# EAGLE design telemetry-4L (EAGLE 7.7.0)
COMPANY: FAR; REV: 3

## Sheet 1 of 2
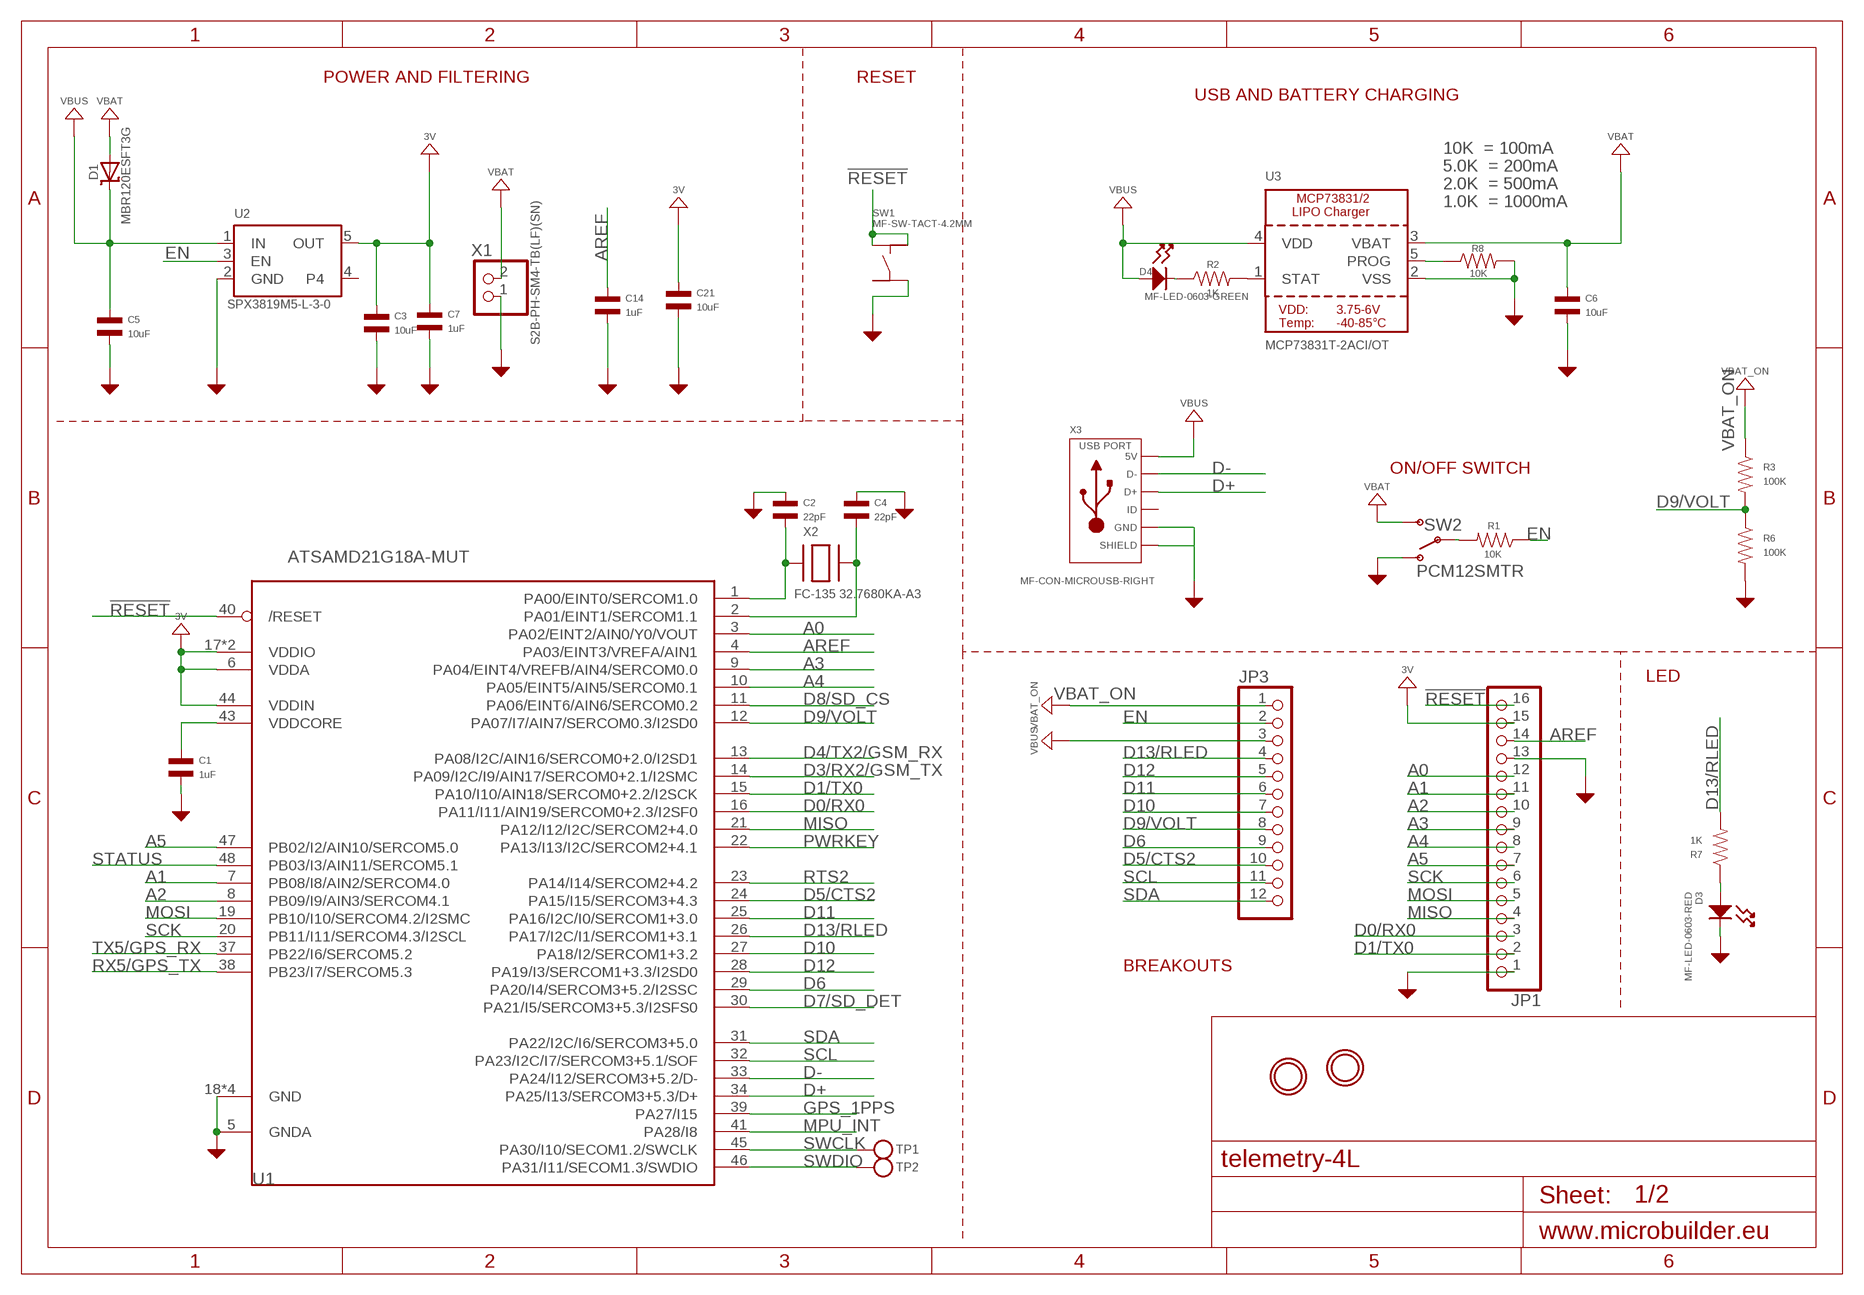
[diagram p0: schematic, sheet 1]
FRAME1 (FRAME_A4): POPULATE: 0

### Parts
C1  1uF  CAPACITOR_NP_0402  [C0402]
C2  22pF  CAPACITOR_NP_0402  [C0402]
C3  10uF  CAPACITOR_NP_0603  [C0603]
C4  22pF  CAPACITOR_NP_0402  [C0402]
C5  10uF  CAPACITOR_NP_0603  [C0603]
C6  10uF  CAPACITOR_NP_0603  [C0603]
C7  1uF  CAPACITOR_NP_0402  [C0402]
C14  1uF  CAPACITOR_NP_0402  [C0402]
C21  10uF  CAPACITOR_NP_0603  [C0603]
D1  MBR120ESFT3G  DIODE-SCHOTTKYSOD-123  [SOD-123]
D3  MF-LED-0603-RED  LED_SINGLE-0603-RED  [LED0603]
D4  MF-LED-0603-GREEN  LED_SINGLE-0603-GREEN  [LED0603]
JP1  HEADER-1X16ROUND  [1X16_ROUND]
JP3  HEADER-1X12  [1X12_ROUND]
R1  10K  RESISTOR_0402  [R0402]
R2  1K  RESISTOR_0402  [R0402]
R3  100K  RESISTOR_0402  [R0402]
R6  100K  RESISTOR_0402  [R0402]
R7  1K  RESISTOR_0402  [R0402]
R8  10K  RESISTOR_0402  [R0402]
SW1  MF-SW-TACT-4.2MM  TACT_4.2MM  [TACT4.2MM]
SW2  PCM12SMTR  SWITCH_SPDT  [KPS-1290]
TP1  TESTPOINTROUND1.5MM  [TESTPOINT_ROUND_1.5MM]
TP2  TESTPOINTROUND1.5MM  [TESTPOINT_ROUND_1.5MM]
U1  ATSAMD21G18A-MUT  ATSAMD21J_QFN  [TQFN48_7MM]
U2  SPX3819M5-L-3-0  VREG_SOT23-5  [SOT23-5]
U3  MCP73831T-2ACI/OT  MCP73831/2  [SOT23-5]
U$31  MOUNTINGHOLE2.5  [MOUNTINGHOLE_2.5_PLATED]
U$32  MOUNTINGHOLE2.5  [MOUNTINGHOLE_2.5_PLATED]
X1  S2B-PH-SM4-TB(LF)(SN)  CON_JST_PH_2PIN  [JSTPH2]
X2  FC-135 32.7680KA-A3  XTAL-3.2X1.5  [XTAL3215]
X3  MF-CON-MICROUSB-RIGHT  USB_MICRO_RIGHT  [MICROUSB-RIGHT]

### Nets
!RESET: JP1.16 SW1.P$1 SW1.P$2 U1.40(/RESET)
+3V: C3.P$1 C7.P$1 C21.P$1 JP1.15 U1.6(VDDA) U1.17(VDDIO) U1.36(VDDIO) U1.44(VDDIN) U2.5(OUT) ; supply symbol labelled 3V ; also sheet 2
A0: JP1.12 U1.3(PA02/EINT2/AIN0/Y0/VOUT)
A1: JP1.11 U1.7(PB08/I8/AIN2/SERCOM4.0)
A2: JP1.10 U1.8(PB09/I9/AIN3/SERCOM4.1)
A3: JP1.9 U1.9(PA04/EINT4/VREFB/AIN4/SERCOM0.0)
A4: JP1.8 U1.10(PA05/EINT5/AIN5/SERCOM0.1)
A5: JP1.7 U1.47(PB02/I2/AIN10/SERCOM5.0)
AREF: C14.P$1 JP1.14 U1.4(PA03/EINT3/VREFA/AIN1)
D0/RX0: JP1.3 U1.16(PA11/I11/AIN19/SERCOM0+2.3/I2SF0)
D1/TX0: JP1.2 U1.15(PA10/I10/AIN18/SERCOM0+2.2/I2SCK)
D3/RX2/GSM_TX: U1.14(PA09/I2C/I9/AIN17/SERCOM0+2.1/I2SMC) ; also sheet 2
D4/TX2/GSM_RX: U1.13(PA08/I2C/AIN16/SERCOM0+2.0/I2SD1) ; also sheet 2
D5/CTS2: JP3.10 U1.24(PA15/I15/SERCOM3+4.3) ; also sheet 2
D6: JP3.9 U1.29(PA20/I4/SERCOM3+5.2/I2SSC)
D7/SD_DET: U1.30(PA21/I5/SERCOM3+5.3/I2SFS0) ; also sheet 2
D8/SD_CS: U1.11(PA06/EINT6/AIN6/SERCOM0.2) ; also sheet 2
D9/VOLT: JP3.8 R3.P$2 R6.P$1 U1.12(PA07/I7/AIN7/SERCOM0.3/I2SD0)
D10: JP3.7 U1.27(PA18/I2/SERCOM1+3.2)
D11: JP3.6 U1.25(PA16/I2C/I0/SERCOM1+3.0)
D12: JP3.5 U1.28(PA19/I3/SERCOM1+3.3/I2SD0)
D13/RLED: JP3.4 R7.P$2 U1.26(PA17/I2C/I1/SERCOM1+3.1)
D+: U1.34(PA25/I13/SERCOM3+5.3/D+) X3.3(D+)
D-: U1.33(PA24/I12/SERCOM3+5.2/D-) X3.2(D-)
EN: JP3.2 R1.P$1 U2.3(EN) ; also sheet 2
GND: C1.P$2 C2.P$1 C3.P$2 C4.P$1 C5.P$2 C6.P$2 C7.P$2 C14.P$2 C21.P$2 D3.CATHODE JP1.1 JP1.13 R6.P$2 R8.P$2 SW1.P$4 SW2.O U1.5(GNDA) U1.18(GND) U1.35(GND) U1.42(GND) U1.THERMAL(GND) U2.2(GND) U3.2(VSS) X1.1 X3.5(GND) X3.S1(SLD) X3.S2(SLD) X3.S3(SLD) X3.S4(SLD) X3.S5(SLD) X3.S6(SLD) ; also sheet 2
GPS_1PPS: U1.39(PA27/I15) ; also sheet 2
MISO: JP1.4 U1.21(PA12/I12/I2C/SERCOM2+4.0) ; also sheet 2
MOSI: JP1.5 U1.19(PB10/I10/SERCOM4.2/I2SMC) ; also sheet 2
MPU_INT: U1.41(PA28/I8) ; also sheet 2
N$1: D4.CATHODE R2.P$1
N$3: R2.P$2 U3.1(STAT)
N$4: R8.P$1 U3.5(PROG)
N$5: C2.P$2 U1.1(PA00/EINT0/SERCOM1.0) X2.P$1
N$7: C4.P$2 U1.2(PA01/EINT1/SERCOM1.1) X2.P$2
N$8: D3.ANODE R7.P$1
N$11: R1.P$2 SW2.P
PWRKEY: U1.22(PA13/I13/I2C/SERCOM2+4.1) ; also sheet 2
RTS2: U1.23(PA14/I14/SERCOM2+4.2) ; also sheet 2
RX5/GPS_TX: U1.38(PB23/I7/SERCOM5.3) ; also sheet 2
SCK: JP1.6 U1.20(PB11/I11/SERCOM4.3/I2SCL) ; also sheet 2
SCL: JP3.11 U1.32(PA23/I2C/I7/SERCOM3+5.1/SOF) ; also sheet 2
SDA: JP3.12 U1.31(PA22/I2C/I6/SERCOM3+5.0) ; also sheet 2
STATUS: U1.48(PB03/I3/AIN11/SERCOM5.1) ; also sheet 2
SWCLK: TP1.P$1 U1.45(PA30/I10/SECOM1.2/SWCLK) ; also sheet 2
SWDIO: TP2.P$1 U1.46(PA31/I11/SECOM1.3/SWDIO)
TX5/GPS_RX: U1.37(PB22/I6/SERCOM5.2) ; also sheet 2
VBAT: C6.P$1 D1.A SW2.S U3.3(VBAT) X1.2 ; also sheet 2
VBAT_ON: JP3.1 R3.P$1 ; also sheet 2
VBUS: C5.P$1 D1.C D4.ANODE JP3.3 U2.1(IN) U3.4(VDD) X3.1(5V)
VDDCORE: C1.P$1 U1.43(VDDCORE)
Unconnected: SW1.P$3 U2.4 X3.4(ID)

### Notes on the sheet
- POWER AND FILTERING | RESET
- USB AND BATTERY CHARGING
- 10K  = 100mA
- 5.0K  = 200mA
- 2.0K  = 500mA
- 1.0K  = 1000mA
- ON/OFF SWITCH
- LED
- BREAKOUTS

## Sheet 2 of 2
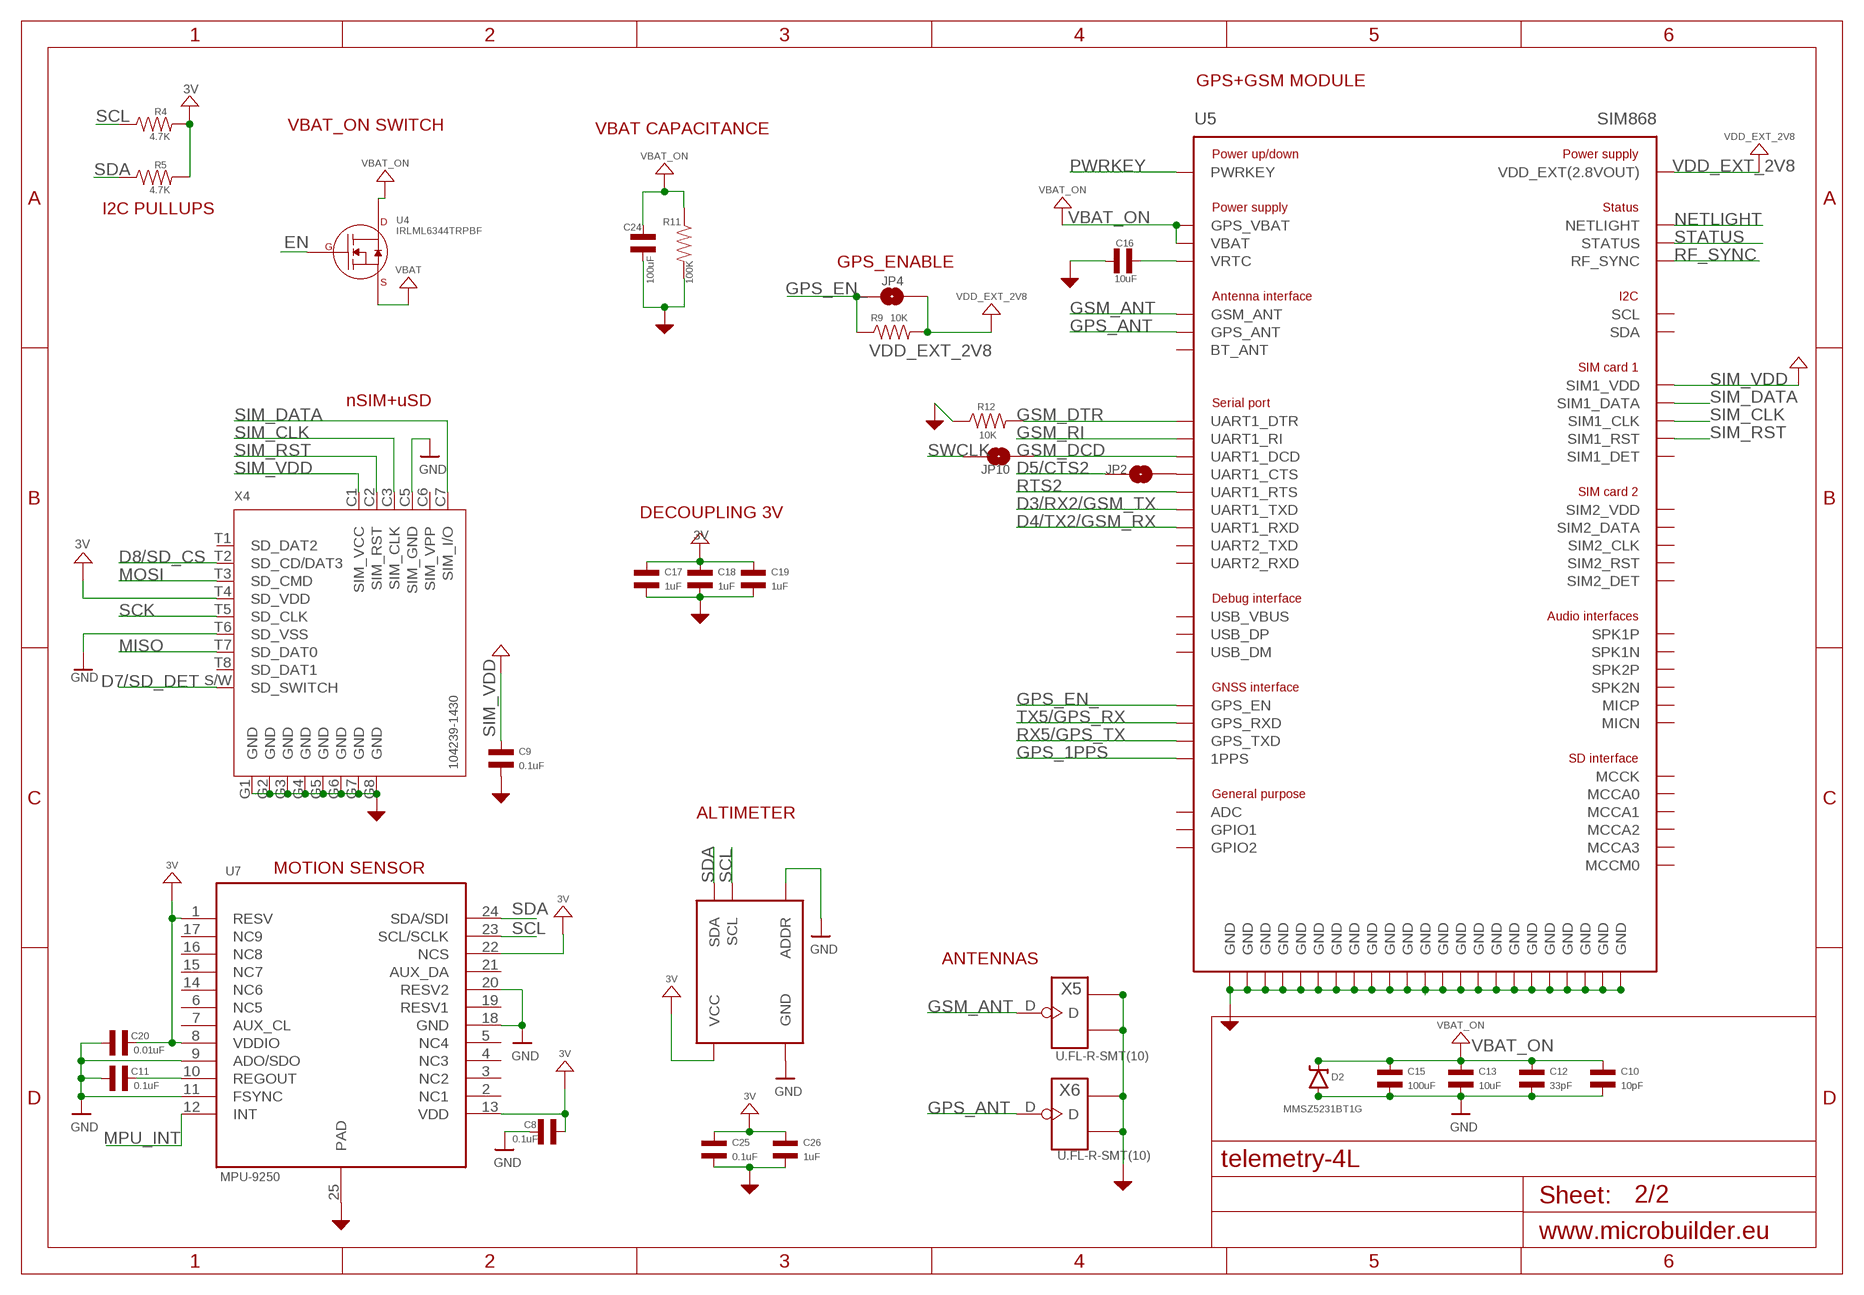
[diagram p1: schematic, sheet 2]
FRAME2 (FRAME_A4): POPULATE: 0

### Parts
C8  0.1uF  CAPACITOR_NP_0402  [C0402]
C9  0.1uF  CAPACITOR_NP_0402  [C0402]
C10  10pF  CAPACITOR_NP_0402  [C0402]
C11  0.1uF  CAPACITOR_NP_0402  [C0402]
C12  33pF  CAPACITOR_NP_0402  [C0402]
C13  10uF  CAPACITOR_NP_0603  [C0603]
C15  100uF  CAPACITOR_NP_1206  [C1206]
C16  10uF  CAPACITOR_NP_0603  [C0603]
C17  1uF  CAPACITOR_NP_0402  [C0402]
C18  1uF  CAPACITOR_NP_0402  [C0402]
C19  1uF  CAPACITOR_NP_0402  [C0402]
C20  0.01uF  CAPACITOR_NP_0402  [C0402]
C24  100uF  CAPACITOR_NP_1206  [C1206]
C25  0.1uF  CAPACITOR_NP_0402  [C0402]
C26  1uF  CAPACITOR_NP_0402  [C0402]
D2  MMSZ5231BT1G  [SOD-123]
JP2  JUMPER-PAD-2-NOYES_SILK  [PAD-JUMPER-2-NO_YES_SILK]
JP4  JUMPER-PAD-2-NOYES_SILK  [PAD-JUMPER-2-NO_YES_SILK]
JP10  JUMPER-PAD-2-NOYES_SILK  [PAD-JUMPER-2-NO_YES_SILK]
R4  4.7K  RESISTOR_0402  [R0402]
R5  4.7K  RESISTOR_0402  [R0402]
R9  10K  RESISTOR_0402  [R0402]
R11  100K  RESISTOR_0402  [R0402]
R12  10K  RESISTOR_0402  [R0402]
U4  IRLML6344TRPBF  N-CHANNEL_FET_SOT-23-3  [SOT-23-3]
U5  SIM868  [SIM868]
U6  BMP280  [LGA-8]
U7  MPU-9250  [LEAD-QFN24]
X4  104239-1430  MOLEX-SD+SIM-104239  [MOLEX-SD+SIM-104239]
X5  U.FL-R-SMT(10)  ANTENNA-CONN-U-FL(3P)  [U-FL3P-SMD-2.6X2.6X1.0MM]
X6  U.FL-R-SMT(10)  ANTENNA-CONN-U-FL(3P)  [U-FL3P-SMD-2.6X2.6X1.0MM]

### Nets
+3V: C8.P$2 C17.P$1 C18.P$1 C19.P$1 C20.P$2 C25.P$1 C26.P$1 R4.P$2 R5.P$2 U6.P2(VCC) U6.P6(VCC) U6.P8(VCC) U7.1(RESV) U7.8(VDDIO) U7.13(VDD) U7.22(NCS) X4.T4(SD_VDD) ; supply symbol labelled 3V ; also sheet 1
D3/RX2/GSM_TX: U5.1_(UART1_TXD) ; also sheet 1
D4/TX2/GSM_RX: U5.2_(UART1_RXD) ; also sheet 1
D5/CTS2: JP2.1 ; also sheet 1
D7/SD_DET: X4.S/W(SD_SWITCH) ; also sheet 1
D8/SD_CS: X4.T2(SD_CD/DAT3) ; also sheet 1
EN: U4.P$1(GATE) ; also sheet 1
GND: C8.P$1 C9.P$2 C10.P$2 C11.P$1 C12.P$2 C13.P$2 C15.P$2 C16.P$1 C17.P$2 C18.P$2 C19.P$2 C20.P$1 C24.P$2 C25.P$2 C26.P$2 D2.A R11.P$2 R12.P$1 U5.8_(GND) U5.13_(GND) U5.19_(GND) U5.21_(GND) U5.27_(GND) U5.30_(GND) U5.31_(GND) U5.33_(GND) U5.36_(GND) U5.37_(GND) U5.45_(GND) U5.63_(GND) U5.66_(GND) U5.67_(GND) U5.69_(GND) U5.70_(GND) U5.71_(GND) U5.72_(GND) U5.73_(GND) U5.74_(GND) U5.75_(GND) U5.76_(GND) U5.77_(GND) U6.P1(GND) U6.P5(ADDR) U6.P7(GND) U7.9(ADO/SDO) U7.11(FSYNC) U7.18(GND) U7.20(RESV2) U7.25(PAD) X4.C5(SIM_GND) X4.G1(GND) X4.G2(GND) X4.G3(GND) X4.G4(GND) X4.G5(GND) X4.G6(GND) X4.G7(GND) X4.G8(GND) X4.T6(SD_VSS) X5.GND1 X5.GND2 X6.GND1 X6.GND2 ; also sheet 1
GPS_1PPS: U5.60_(1PPS) ; also sheet 1
GPS_ANT: U5.68_(GPS_ANT) X6.D
GPS_EN_: JP4.1 R9.P$1 U5.59_(GPS_EN)
GSM_ANT: U5.32_(GSM_ANT) X5.D
GSM_DCD: JP10.2 U5.5_(UART1_DCD)
GSM_DTR: R12.P$2 U5.6_(UART1_DTR)
GSM_RI: U5.7_(UART1_RI)
MISO: X4.T7(SD_DAT0) ; also sheet 1
MOSI: X4.T3(SD_CMD) ; also sheet 1
MPU_INT: U7.12(INT) ; also sheet 1
N$6: JP2.2 U5.4_(UART1_CTS)
N$23: C11.P$2 U7.10(REGOUT)
N$29: C16.P$2 U5.28_(VRTC)
NETLIGHT: U5.41_(NETLIGHT)
PWRKEY: U5.39_(PWRKEY) ; also sheet 1
RF_SYNC: U5.29_(RF_SYNC)
RTS2: U5.3_(UART1_RTS) ; also sheet 1
RX5/GPS_TX: U5.61_(GPS_TXD) ; also sheet 1
SCK: X4.T5(SD_CLK) ; also sheet 1
SCL: R4.P$1 U6.P4(SCL) U7.23(SCL/SCLK) ; also sheet 1
SDA: R5.P$1 U6.P3(SDA) U7.24(SDA/SDI) ; also sheet 1
SIM_CLK: U5.16_(SIM1_CLK) X4.C3(SIM_CLK)
SIM_DATA: U5.15_(SIM1_DATA) X4.C7(SIM_I/O)
SIM_RST: U5.17_(SIM1_RST) X4.C2(SIM_RST)
SIM_VDD: C9.P$1 U5.18_(SIM1_VDD) X4.C1(SIM_VCC)
STATUS: U5.42_(STATUS) ; also sheet 1
SWCLK: JP10.1 ; also sheet 1
TX5/GPS_RX: U5.62_(GPS_RXD) ; also sheet 1
VBAT: U4.P$2(SOURCE) ; also sheet 1
VBAT_ON: C10.P$1 C12.P$1 C13.P$1 C15.P$1 C24.P$1 D2.C R11.P$1 U4.P$3(DRAIN) U5.34_(GPS_VBAT) U5.35_(VBAT) ; also sheet 1
VDD_EXT_2V8: JP4.2 R9.P$2 U5.40_(VDD_EXT(2.8VOUT))
Unconnected: U5.9_(MICP) U5.10_(MICN) U5.11_(SPK1P) U5.12_(SPK1N) U5.14_(SIM1_DET) U5.20_(BT_ANT) U5.22_(UART2_TXD) U5.23_(UART2_RXD) U5.25_(USB_DP) U5.26_(USB_DM) U5.38_(ADC) U5.43_(SPK2N) U5.44_(SPK2P) U5.46_(MCCA3) U5.47_(MCCA2) U5.48_(MCCA1) U5.49_(MCCA0) U5.50_(MCCK) U5.51_(MCCM0) U5.52_(SIM2_DET) U5.53_(SIM2_DATA) U5.54_(SIM2_CLK) U5.55_(SIM2_RST) U5.57_(GPIO1) U5.58_(GPIO2) U5.64_(SDA) U5.65_(SCL) U7.2(NC1) U7.3(NC2) U7.4(NC3) U7.5(NC4) U7.6(NC5) U7.7(AUX_CL) U7.14(NC6) U7.15(NC7) U7.16(NC8) U7.17(NC9) U7.19(RESV1) U7.21(AUX_DA) X4.C6(SIM_VPP) X4.T1(SD_DAT2) X4.T8(SD_DAT1)

### Notes on the sheet
- GPS+GSM MODULE
- VBAT_ON SWITCH | VBAT CAPACITANCE
- I2C PULLUPS
- GPS_ENABLE
- nSIM+uSD
- DECOUPLING 3V
- ALTIMETER
- MOTION SENSOR
- ANTENNAS

## Power pins joined to a net without a drawn wire
SIM2_VDD: U5.56_(SIM2_VDD)
USB_VBUS: U5.24_(USB_VBUS)

## Library data of the parts
C1 C2 C4 C7-C9 C11 C14 C17-C20 C25 C26 = MF_Passives:CAPACITOR_NP: Library: MF_Passives Description: Device for Non-Polarized Capacitors. Manufacture part number (MPN) can be added via Attributes. Check https://factory.macrofab.com/parts for the house parts list.; POPULATE: 1
C3 C5 C6 C13 C16 C21 = MF_Passives:CAPACITOR_NP: Library: MF_Passives Description: Device for Non-Polarized Capacitors. Manufacture part number (MPN) can be added via Attributes. Check https://factory.macrofab.com/parts for the house parts list.; MPN: GRM188R60J106ME47D; POPULATE: 1
C10 = MF_Passives:CAPACITOR_NP: Library: MF_Passives Description: Device for Non-Polarized Capacitors. Manufacture part number (MPN) can be added via Attributes. Check https://factory.macrofab.com/parts for the house parts list.; MPN: GRM1555C1H100JA01J; POPULATE: 1
C12 = MF_Passives:CAPACITOR_NP: Library: MF_Passives Description: Device for Non-Polarized Capacitors. Manufacture part number (MPN) can be added via Attributes. Check https://factory.macrofab.com/parts for the house parts list.; MPN: GRM1555C1H330JA01D; POPULATE: 1
C15 C24 = MF_Passives:CAPACITOR_NP: Library: MF_Passives Description: Device for Non-Polarized Capacitors. Manufacture part number (MPN) can be added via Attributes. Check https://factory.macrofab.com/parts for the house parts list.; MPN: CL31A107MQHNNNE; POPULATE: 1
D1 = microbuilder:DIODE-SCHOTTKY
D2 = Deegou-Diodes:MMSZ5231BT1G: DIODE ZENER 5.1V 500MW SOD123; MFR: ON SEMICONDUCTOR; MPN: MMSZ5231BT1G
D3 = MF_LEDs:LED_SINGLE: Library: MF_LEDs Description: Device for Single LED Packages. Manufacture part number (MFG#) can be added via Attributes.; HOUSEPART: YES; MPN: MF-LED-0603-RED; POPULATE: 1; URL: https://factory.macrofab.com/part/MF-LED-0603-RED
D4 = MF_LEDs:LED_SINGLE: Library: MF_LEDs Description: Device for Single LED Packages. Manufacture part number (MFG#) can be added via Attributes.; HOUSEPART: YES; MPN: MF-LED-0603-GREEN; POPULATE: 1; URL: https://factory.macrofab.com/part/MF-LED-0603-GREEN
JP1 = microbuilder:HEADER-1X16: PIN HEADER; POPULATE: 0
JP2 JP4 JP10 = SparkFun-Passives:JUMPER-PAD-2-NO; POPULATE: 0
JP3 = microbuilder:HEADER-1X12
R1-R9 R11 R12 = MF_Passives:RESISTOR: Library: MF_Passives Description: Device for Resistors. Manufacture part number (MPN), Voltage, Tolerance, and Wattage Rating can be added via Attributes. Check https://factory.macrofab.com/parts for the house parts list.; POPULATE: 1
SW1 = MF_Switches:TACT: Library: MF_Switches Description: Device for Tact Switches. Manufacture part number (MFG#) can be added via Attributes.; HOUSEPART: YES; MPN: MF-SW-TACT-4.2MM; POPULATE: 1; URL: https://factory.macrofab.com/part/MF-SW-TACT-4.2MM
SW2 = SparkFun-Electromechanical:SWITCH_SPDT: SWCH-10651 Side-actuated SPDT slide switch, as used on the Arduino Pro; PROD_ID: SWCH-10651
TP1 TP2 = microbuilder:TESTPOINT: Test Point Various test points for characterisation and PCB testing TESTPOINT_SMT - Compact Surface Mount Test Point [Digikey: 5016KTR-ND]; POPULATE: 0
U1 = microbuilder:ATSAMD21J
U2 = microbuilder:VREG_SOT23-5: SOT23-5 Fixed Voltage Regulators Part Current Out V Out V In V Dropout θJA (°C/W) TJ (°C) Digikey Part No. ADP121 150mA 3.3V 3.4-5.5V 0.09V @ 150mA -- -- ADP121-AUJZ33R7CT-ND ADP121 150mA 3.0V 3.1-5.5V 0.09V @ 150mA -- -- ADP121-AUJZ30R7CT-ND ADP122 300mA 3.3V 3.4-5.5V 0.085V @ 300mA -- -- ADP122AUJZ-3.3-R7CT-ND ADP1712 300mA 3.3V 3.5-5.5V 0.17V @ 300mA -- -- ADP1712AUJZ-3.3-R7TR-ND AP7311 (Low Cost) 150mA 3.3V 3.5-6V 0.15V @ 150mA -- -- AP7311-33WG-7DICT-ND LD39015M18R 150mA 1.8V 1.9V-5.5V 0.08V @ 100mA -- -- 497-6977-1-ND LP2985A-33DBVR 150mA 3.3V 3.3-16V 0.28V @ 150mA 206 150 296-18479-1-ND MCP1824T-3302E/OT 300mA 3.3V 3.5V-6V 0.2V @ 300mA -- -- MCP1824T-3302E/OTCT-ND MIC5205-2.5YM5 TR 150mA 2.5V 2.7-16V 0.165V @ 150mA -- -- 576-1257-2-ND MIC5205-3.0YM5 TR 150mA 3.0V 3.2V-16V 0.165V @ 150mA -- -- 576-1258-2-ND MIC5205-3.3YM5 TR 150mA 3.3V 3.5V-16V 0.165V @ 150mA -- -- 576-1259-2-ND TPS780330220 150mA 3.3V+2.2V 3.6-5.5V 250mV Max -- -- 296-23332-1-ND TDA3663/N1,135 100mA 3.3V 3.5-45V 0.18V @ 50mA -- -- 568-5343-1-ND Max operating temp can be calculated using θJA, TJ (max junction temperature), and power in watts. Set the "Maximum Ambient Temperature" until it reaches TJ ("Max Junction Temperature"), which is the absolute limit for safe use of the regulator: Heat Sink Temperature Calculator <http://www.daycounter.com/Calculators/Heat-Sink-Temperature-Calculator.phtml> For example, With 12V source into a 3.3V LP2985 and a 30mA load, we are dissipating (12V-3.3V) * 0.03A = 0.261W. With a θJA of 206 °C/W, a TJ of 150°C, and 261mW we can safely use the chip without a heat sink up to 75°C (=147.1°C Junction Temperature).
U3 = microbuilder:MCP73831/2: MCP73831/2 LIPO Charger VDD: 3.75 - 6V Temp -40 - 85°C Programmable Charge Rate: 15-500mA NOTE: STAT is a tri-state logic output on the MCP73831 and an open-drain output on the MCP73832. SOT23-5 with 4.2V output and tri-state logic on STAT = MCP73831T-2ACI/OT
U4 = MF_Discrete_Semiconductor:N-CHANNEL_FET: Library: MF_Discrete_Semiconductor Description: Device for Single N-Channel Mosfet. Manufacture part number (MFG#) can be added via Attributes.; HOUSEPART: NO; POPULATE: 1
U5 = SIM868:SIM868; CONSIGN: 1; MPN: SIM868
U6 = BMP280:BMP280: A 100nF capacitor is recommended between Vdd and GND, and also between Vddio and GND. Vdd & Vddio 3.3v I2C Address: ADDR -> Vddio = 0x77, ADDR -> GND = 0x76
U7 = misc:MPU-9250
U$31 U$32 = microbuilder:MOUNTINGHOLE: Mounting Hole For #2 screws (0.086"/2.18mm width, 0.094"/2.4mm hole) use 2.5mm; BOM: EXCLUDE; POPULATE: 0
X1 = microbuilder:CON_JST_PH_2PIN: JST 2-Pin Right-Angle Connector PH-Series - 4UConnector: 17311 SH-Series - 4UConnector: 07278
X2 = adafruit2:XTAL: Low cost SMT crystals, no capacitors included http://www.ladyada.net/library/eagle
X3 = MF_Connectors:USB: Library: MF_Connectors Description: 5 Pin USB Connectors. SLD is the shield connection. Usually tied to ground through a small ferrite bead.; HOUSEPART: YES; MPN: MF-CON-MICROUSB-RIGHT; POPULATE: 1; URL: https://factory.macrofab.com/part/MF-CON-MICROUSB-RIGHT
X4 = SimSdCombo:MOLEX-SD+SIM-104239: microSD/Nano-SIM Combo Connector Molex - 1042391430 Description: microSD/Nano-SIM Combo Connector 2.05mm Height, Pull-Lever Eject, Normal Mount, With Detect Switch, 8-Circuit microSD* Card Type, 6-Circuit Nano-SIM Card Type; MPN: 104239-1430; VALUE: VSHO-21-3301
X5 X6 = Seeed-Connector -2016:ANTENNA-CONN-U-FL(3P): 320110048; VALUE: U-FL

## Board
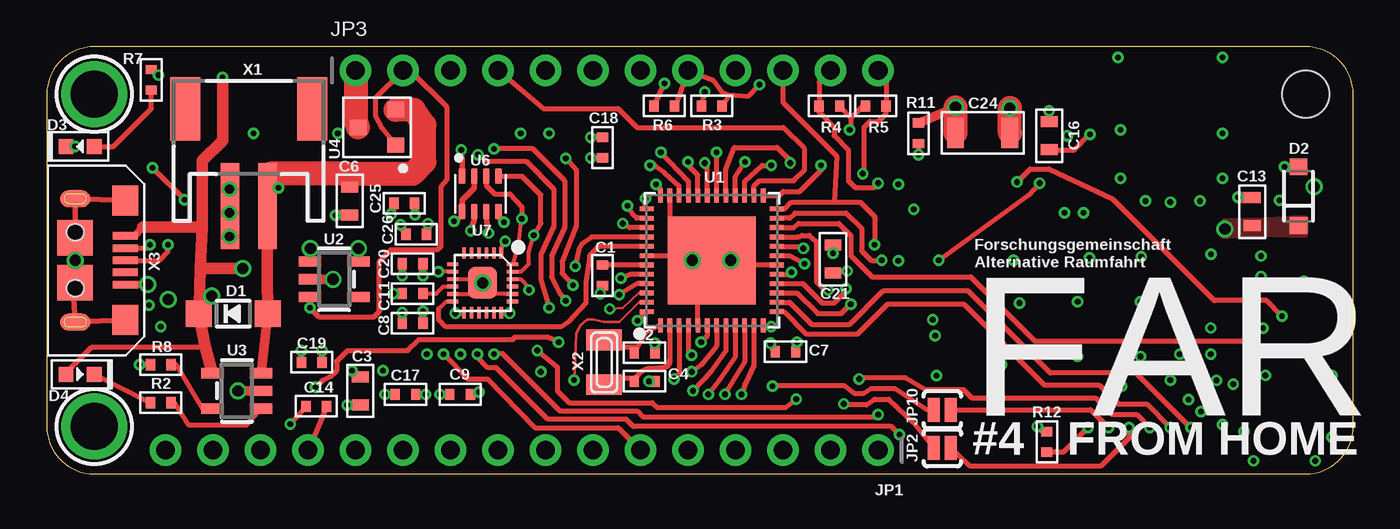
[diagram p2: board, top side]
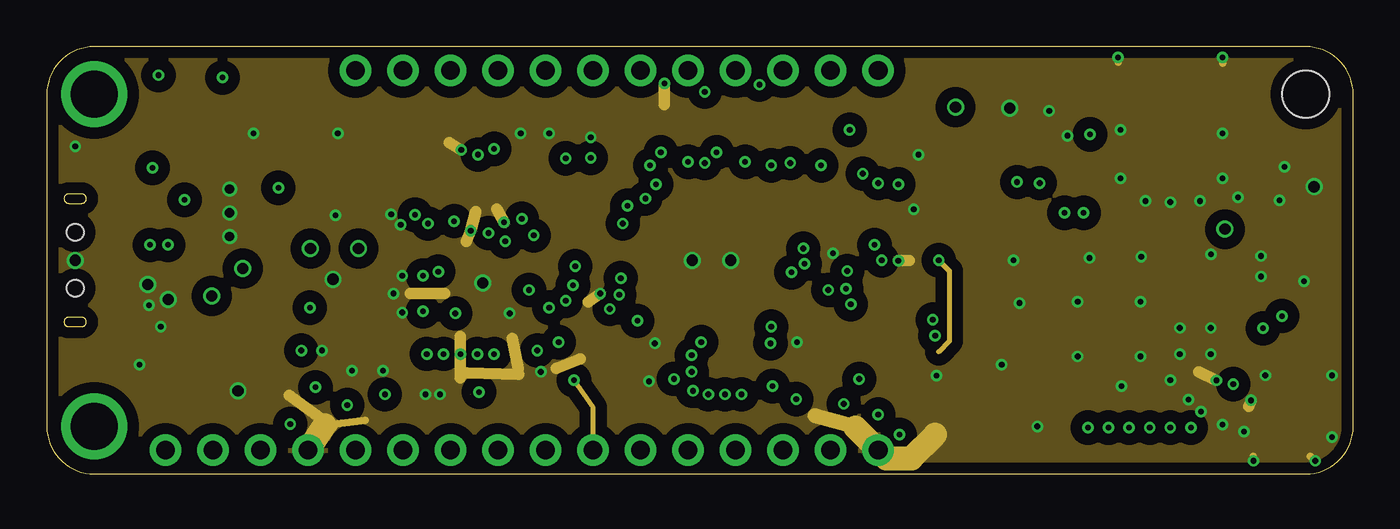
[diagram p3: board, inner layer $GND]
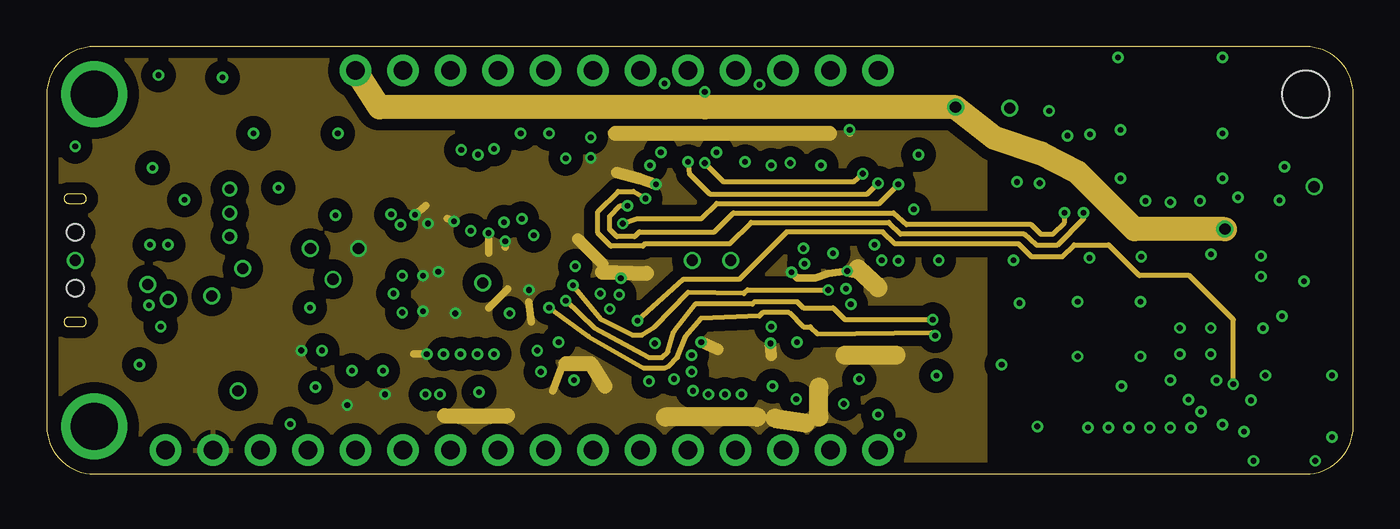
[diagram p4: board, inner layer Route15]
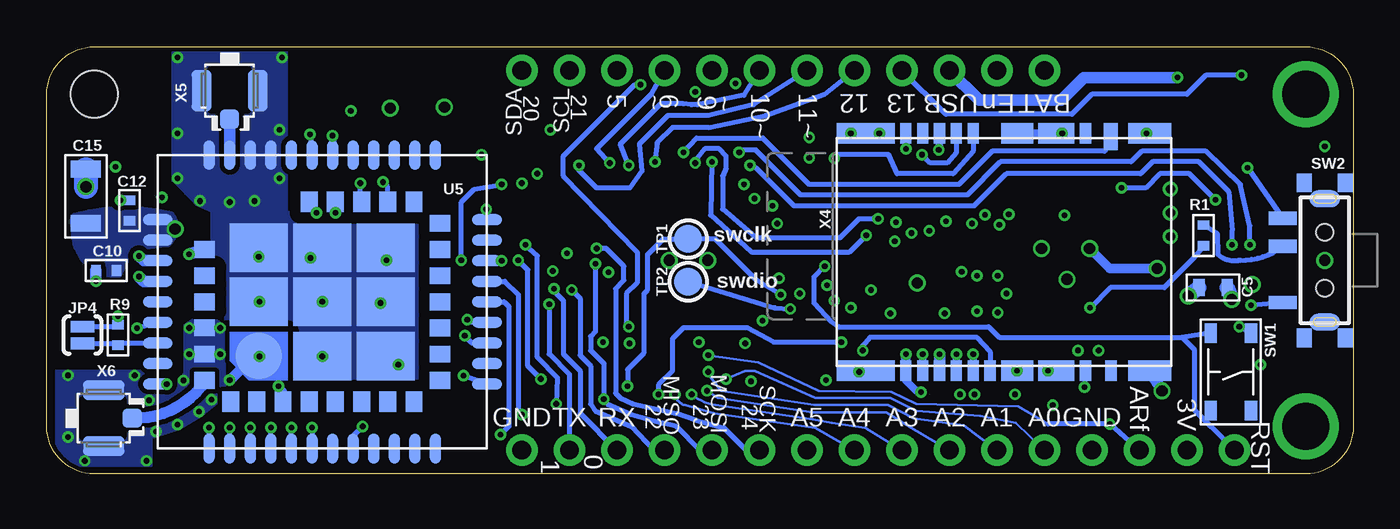
[diagram p5: board, bottom side, seen from below]

Size 69.85 x 22.86 mm. Coordinates in mm from the lower left corner, seen from the top.
Outline: 2.54,0 67.31,0 arc90 69.85,2.54 69.85,20.32 arc90 67.31,22.86 2.54,22.86 arc90 0,20.32 0,2.54 arc90 2.54,0
Copper layers (1*2*15*16): Top 0.035mm / dielectric 0.23mm / $GND 0.035mm / dielectric 0.93mm / Route15 0.035mm / dielectric 0.23mm / Bottom 0.035mm
Design rules "MF_Standard_4_Layer": minimum track width 5mil, minimum drill 12mil, track to track 5mil, track to pad 5mil, pad to pad 5mil, via to via 5mil, smd to smd 0mil, copper to edge 10mil, drill to drill 10mil, minimum pad ring 6mil, minimum via ring 6mil, stop-mask expansion 2mil, vias tented up to drill 25mil, thermal gap 10mil
Holes 2.54 mm at 67.31,20.32

### Footprints (pad centres in the part's own frame; a part is rotated, then mirrored left to right if it is on the bottom)
C0402 = smd 0.5 x 0.6: P$1 -0.55,0; P$2 0.55,0
C0603 = smd 0.6 x 0.9: P$1 -0.75,0; P$2 0.75,0
C1206 = smd 0.9 x 1.6: P$1 -1.45,0; P$2 1.45,0
SOD-123 = smd 1.4 x 1.4: A 1.85,0; C -1.85,0
SOD-123' = smd 0.9 x 0.95: A 1.575,0; C -1.575,0
LED0603 = smd 0.8 x 0.8: ANODE 0.75,0; CATHODE -0.75,0
1X16_ROUND = drill 1 pad 1.676: 1 -19.05,0; 2 -16.51,0; 3 -13.97,0; 4 -11.43,0; 5 -8.89,0; 6 -6.35,0; 7 -3.81,0; 8 -1.27,0; 9 1.27,0; 10 3.81,0; 11 6.35,0; 12 8.89,0; 13 11.43,0; 14 13.97,0; 15 16.51,0; 16 19.05,0
PAD-JUMPER-2-NO_YES_SILK = smd 0.635 x 1.27: 1 -0.45,0; 2 0.45,0
1X12_ROUND = drill 1 pad 1.676: 1 -13.97,0; 2 -11.43,0; 3 -8.89,0; 4 -6.35,0; 5 -3.81,0; 6 -1.27,0; 7 1.27,0; 8 3.81,0; 9 6.35,0; 10 8.89,0; 11 11.43,0; 12 13.97,0
R0402 = smd 0.5 x 0.6: P$1 -0.55,0; P$2 0.55,0
TACT4.2MM = smd 1.05 x 0.65: P$1 -2.075,1.075; P$2 2.075,1.075; P$3 -2.075,-1.075; P$4 2.075,-1.075
KPS-1290 = smd 0.7 x 1.5: O -2.25,2.25; P 0.75,2.25; S 2.25,2.25 | smd 1 x 0.8: P$1 -4.15,1.1; P$2 -4.15,-1.1; P$3 4.15,-1.1; P$4 4.15,1.1 | hole 0.9: -1.5,0; 1.5,0
TESTPOINT_ROUND_1.5MM = smd 1.5 x 1.5: P$1 0,0
TQFN48_7MM = smd 0.25 x 0.75: 1 -2.75,-3.475; 2 -2.25,-3.475; 3 -1.75,-3.475; 4 -1.25,-3.475; 5 -0.75,-3.475; 6 -0.25,-3.475; 7 0.25,-3.475; 8 0.75,-3.475; 9 1.25,-3.475; 10 1.75,-3.475; 11 2.25,-3.475; 12 2.75,-3.475; 25 2.75,3.475; 26 2.25,3.475; 27 1.75,3.475; 28 1.25,3.475; 29 0.75,3.475; 30 0.25,3.475; 31 -0.25,3.475; 32 -0.75,3.475; 33 -1.25,3.475; 34 -1.75,3.475; 35 -2.25,3.475; 36 -2.75,3.475 | smd 0.75 x 0.25: 13 3.475,-2.75; 14 3.475,-2.25; 15 3.475,-1.75; 16 3.475,-1.25; 17 3.475,-0.75; 18 3.475,-0.25; 19 3.475,0.25; 20 3.475,0.75; 21 3.475,1.25; 22 3.475,1.75; 23 3.475,2.25; 24 3.475,2.75; 37 -3.475,2.75; 38 -3.475,2.25; 39 -3.475,1.75; 40 -3.475,1.25; 41 -3.475,0.75; 42 -3.475,0.25; 43 -3.475,-0.25; 44 -3.475,-0.75; 45 -3.475,-1.25; 46 -3.475,-1.75; 47 -3.475,-2.25; 48 -3.475,-2.75 | smd 4.7 x 4.7: THERMAL 0,0
SOT23-5 = smd 0.55 x 1.2: 1 -0.95,-1.3; 2 0,-1.3; 3 0.95,-1.3; 4 0.95,1.3; 5 -0.95,1.3
SOT-23-3 = smd 0.9 x 0.8: P$1 -1,0.95; P$2 -1,-0.95; P$3 1,0
SIM868 = smd 1.6 x 0.6: 1_ -7.85,6.05; 2_ -7.85,4.95; 3_ -7.85,3.85; 4_ -7.85,2.75; 5_ -7.85,1.65; 6_ -7.85,0.55; 7_ -7.85,-0.55; 8_ -7.85,-1.65; 9_ -7.85,-2.75; 10_ -7.85,-3.85; 11_ -7.85,-4.95; 12_ -7.85,-6.05; 22_ 7.85,-6.05; 23_ 7.85,-4.95; 24_ 7.85,-3.85; 25_ 7.85,-2.75; 26_ 7.85,-1.65; 27_ 7.85,-0.55; 28_ 7.85,0.55; 29_ 7.85,1.65; 30_ 7.85,2.75; 31_ 7.85,3.85; 32_ 7.85,4.95; 33_ 7.85,6.05 | smd 0.6 x 1.6: 13_ -4.4,-8.8; 14_ -3.3,-8.8; 15_ -2.2,-8.8; 16_ -1.1,-8.8; 17_ 0,-8.8; 18_ 1.1,-8.8; 19_ 2.2,-8.8; 20_ 3.3,-8.8; 21_ 4.4,-8.8; 34_ 4.4,8.8; 35_ 3.3,8.8; 36_ 2.2,8.8; 37_ 1.1,8.8; 38_ 0,8.8; 39_ -1.1,8.8; 40_ -2.2,8.8; 41_ -3.3,8.8; 42_ -4.4,8.8 | smd 1.1 x 0.9: 43_ -5.35,4.9; 44_ -5.35,3.5; 45_ -5.35,2.1; 46_ -5.35,0.7; 47_ -5.35,-0.7; 48_ -5.35,-2.1; 49_ -5.35,-3.5; 50_ -5.35,-4.9; 58_ 5.35,-4.9; 59_ 5.35,-3.5; 60_ 5.35,-2.1; 61_ 5.35,-0.7; 62_ 5.35,0.7 | smd 0.9 x 1.1: 51_ -4.2,-6.3; 52_ -2.8,-6.3; 53_ -1.4,-6.3; 54_ 0,-6.3; 55_ 1.4,-6.3; 56_ 2.8,-6.3; 57_ 4.2,-6.3; 63_ 2.8,6.3; 64_ 1.4,6.3; 65_ 0,6.3; 66_ -1.38,6.3; 67_ -2.8,6.3; 68_ -4.2,6.3 | smd 2.5 x 2.5: 69_ -2.9,3.4 | smd 2.6 x 3.1: 70_ -2.9,0; 71_ -2.9,-3.4; 72_ 0,-3.4; 73_ 2.9,-3.4; 74_ 2.9,0; 75_ 2.9,3.4; 76_ 0,3.4; 77_ 0,0
LGA-8 = smd 0.8 x 0.35: P1 0.95,0.975; P2 0.95,0.325; P3 0.95,-0.325; P4 0.95,-0.975; P5 -0.95,-0.975; P6 -0.95,-0.325; P7 -0.95,0.325; P8 -0.95,0.975
LEAD-QFN24 = smd 0.6 x 0.2: 1 -1.6,1; 2 -1.6,0.6; 3 -1.6,0.2; 4 -1.6,-0.2; 5 -1.6,-0.6; 6 -1.6,-1; 13 1.6,-1; 14 1.6,-0.6; 15 1.6,-0.2; 16 1.6,0.2; 17 1.6,0.6; 18 1.6,1 | smd 0.2 x 0.6: 7 -1,-1.6; 8 -0.6,-1.6; 9 -0.2,-1.6; 10 0.2,-1.6; 11 0.6,-1.6; 12 1,-1.6; 19 1,1.6; 20 0.6,1.6; 21 0.2,1.6; 22 -0.2,1.6; 23 -0.6,1.6; 24 -1,1.6 | smd 1.7 x 1.54: 25 0,0
MOUNTINGHOLE_2.5_PLATED = drill 2.5 pad 3.2: P$1 0,0
JSTPH2 = smd 1 x 4.6: 1 -1,-3.7; 2 1,-3.7 | smd 1.6 x 3.4: NC1 -3.4,1.5; NC2 3.4,1.5
XTAL3215 = smd 1.1 x 1.9: P$1 1.2,0; P$2 -1.2,0
MICROUSB-RIGHT = smd 0.4 x 1.35: 1 -1.3,1.27; 2 -0.65,1.27; 3 0,1.27; 4 0.65,1.27; 5 1.3,1.27 | smd 0.9 x 1.6: S1 -3.3,-1.4; S2 3.3,-1.4 | smd 1.6 x 1.4: S3 -3.2,1.27; S4 3.2,1.27 | smd 1.9 x 1.9: S5 -1.2,-1.405; S6 1.2,-1.405 | smd 0.9 x 1.6 bottom: S7 -3.3,-1.4; S8 3.3,-1.4
MOLEX-SD+SIM-104239 = smd 1.1 x 0.6: C1 6.35,-5.25; C2 6.35,-4.35; C3 -6.35,-5.25; C5 6.35,-3.45; C6 -6.35,-4.35; C7 -6.35,-2.55; T1 6.35,5.715; T2 6.35,4.36; T3 6.35,-0.75; T4 6.35,-1.65; T5 6.35,-2.55; T6 -6.35,-3.45; T7 -6.35,-1.65; T8 -6.35,4.36 | smd 1.1 x 3.1: G1 -6.35,-7.4; G8 6.35,-7.4 | smd 1.1 x 1.72: G2 -6.35,0.71; G7 6.35,0.71 | smd 1.1 x 1.94: G3 -6.35,2.79; G6 6.35,2.79 | smd 1.1 x 2.3: G4 -6.35,7.8; G5 6.35,7.8 | smd 1.45 x 0.75: S/W -6.175,5.715
U-FL3P-SMD-2.6X2.6X1.0MM = smd 1.05 x 1: D -1.524,0 | smd 2.2 x 1.05: GND1 0,1.5; GND2 0,-1.5

### Placement (x,y rotation side)
C1  29.72,10.62 270 top
C2  31.96,6.48 180 top
C3  16.76,4.45 90 top
C4  31.96,4.95 180 top
C5  7.49,9.97 0 bottom
C6  16.19,14.61 270 top
C7  39.5,6.54 0 top
C8  19.56,8.06 0 top
C9  22.1,4.25 180 top
C10  66.67,10.88 180 bottom
C11  19.56,9.65 0 top
C12  65.43,14.1 90 bottom
C13  64.45,14.03 90 top
C14  14.41,3.62 0 top
C15  67.75,14.86 90 bottom
C16  53.59,18.1 270 top
C17  19.18,4.25 0 top
C18  29.72,17.46 90 top
C19  14.16,5.97 0 top
C20  19.56,11.24 0 top
C21  42.04,11.49 90 top
C24  50.04,18.25 0 top
C25  19.11,14.48 180 top
C26  19.75,12.83 180 top
D1  9.97,8.57 0 top
D2  MMSZ5231BT1G  [SOD-123']  66.93,14.86 90 top
D3  1.78,17.53 0 top
D4  1.78,5.33 180 top
JP1  25.4,1.27 180 top
JP2  47.88,1.4 0 top
JP3  30.48,21.59 0 top
JP4  67.94,7.43 270 bottom
JP10  47.88,3.43 0 top
R1  8,12.76 90 bottom
R2  6.1,3.81 0 top
R3  35.56,19.68 0 top
R4  41.85,19.68 0 top
R5  44.32,19.68 180 top
R6  33.02,19.68 180 top
R7  5.59,21.08 90 top
R8  6.1,5.84 180 top
R9  66.04,7.43 270 bottom
R11  46.61,18.22 270 top
R12  53.47,1.71 270 top
SW1  6.54,5.46 90 bottom
SW2  1.52,11.43 90 bottom
TP1  35.56,12.57 180 bottom
TP2  35.56,10.29 180 bottom
U1  35.56,11.43 0 top
U2  15.37,10.41 270 top
U3  10.16,4.45 90 top
U4  17.65,18.54 180 top
U5  55.12,9.21 90 bottom
U6  23.18,14.99 90 top
U7  23.3,10.22 270 top
U$31  2.54,20.32 0 top
U$32  2.54,2.54 0 top
X1  10.79,18.03 0 top
X2  29.8,5.97 90 top
X3  2.92,11.43 270 top
X4  18.67,11.87 270 bottom
X5  60.07,20.51 90 bottom
X6  66.8,2.98 180 bottom

### Tracks (layer width: path | path; a pad name or v marks a point on that pad's centre or on a via)
!RESET  (via drill 0.3)
  Top 0.254: v28.26,11.11 28.45,12 28.64,12.32 29.13,12.68 U1.40
  Bottom 0.254: 9.14,7.3 18.92,7.3 19.49,7.87 27.5,7.87 27.88,8.13 28.83,9.14 28.83,10.54 v28.26,11.11 | 9.14,7.3 8.51,6.67 8.51,3.43 7.94,2.86 | 7.94,2.86 7.62,2.54 | 7.62,2.54 JP1.16 | 7.62,2.56 7.62,2.54 | SW1.P$2 9.14,7.3 | SW1.P$1 7.94,2.86
+3V  (via drill 0.3, 0.6)
  Top 0.203: U7.22 25.34,10.42 25.78,9.98 v25.78,9.84 | v21.84,8.59 22.24,8.59 U7.13 | U7.8 v20.93,10.82 | U7.1 24.3,12.14 v24.51,12.45
  Top 0.254: C18.P$1 v29.08,16.91 | C19.P$1 v13.61,6.6 | U1.6 35.31,7.37 v34.99,7.05 | U1.44 31.21,10.68 v30.69,10.48 | U1.36 32.79,15.3 v32.58,15.49 | U1.17 39.7,10.68 v39.81,10.79 | R5.P$2 43.62,19.68 42.99,19.05 | 42.99,19.05 42.99,18.48 v42.93,18.41 | R4.P$2 42.4,19.64 42.99,19.05 | 20.11,8.19 C8.P$2 | C26.P$1 20.3,12.93 | C21.P$1 v42.8,10.86
  Top 0.305: v21.78,13.53 22.2,13.76 U6.P8 22.2,14.65 22.85,15.3 U6.P2 | v23.62,12.89 23.5,13.71 U6.P6
  Top 0.406: v18.08,4.25 C17.P$1 | v20.11,8.7 20.11,8.19 | 20.3,12.93 v20.38,13.4 | C25.P$1 v19.68,13.86 | C7.P$1 v38.69,6.99 | C20.P$2 v20.11,10.6 | C3.P$1 v16.07,3.68
  Top 0.508: U2.5 v16.67,12.06
  Route15 0.406: v42.93,18.41 42.93,18.22 | v39.81,10.79 40.13,10.48 41.08,10.48 41.78,10.73 v42.8,10.86 | v23.62,12.89 23.62,11.82 | v20.32,6.41 19.62,6.41 | 19.68,13.84 20.26,14.35 | 30.67,10.41 30.67,10.73 | 25.91,8.13 25.78,9.21 | 23.62,8.89 24.64,9.91 | 27.05,4.45 27.5,5.65 27.75,5.91 | v21.78,13.53 21.4,13.65 | v24.51,12.45 24.51,12.13
  Route15 0.61: v42.8,10.86 43.5,10.73 | v34.99,7.05 35.88,6.67 | v32.58,15.49 31.69,15.81 30.48,16.13 | v38.69,6.99 38.73,6.35 | 29.72,11.24 28.38,12.57
  Route15 0.813: 27.75,5.91 29.08,5.91 29.84,4.7 | 30.42,18.22 41.85,18.22 | 29.72,10.79 32.07,10.73 | 21.27,3.11 24.64,3.11
  Route15 1.016: 43.37,10.99 44.45,9.97 | 37.97,3.05 33.08,3.05 | 38.92,2.98 40.58,2.73 | 41.27,3.05 41.27,4.64 | 45.4,6.35 42.67,6.35
  Bottom 0.406: X4.T4 20.32,6.35 v20.32,6.41
  pour Route15 (isolate 0.61): 0,22.86 0,0 50.16,0 50.16,22.86
A0  (via drill 0.3)
  Top 0.254: U1.3 33.81,5.36 v33.53,5.08
  Bottom 0.127: JP1.12 18.03,2.73 19.94,3.11 23.37,3.37 24.77,4.06 28.77,4.06 32,5.52 32.51,5.52 v33.53,5.08
A1  (via drill 0.3)
  Top 0.127: U1.7
  Top 0.254: U1.7 35.81,6.86 34.99,5.84 v34.48,5.46
  Bottom 0.127: JP1.11 20.83,2.6 23.5,2.98 24.89,3.68 28.83,3.68 33.78,4.45 34.48,5.33 v34.48,5.46
A2  (via drill 0.3)
  Top 0.254: U1.8 36.31,6.59 35.5,5.46 v34.54,4.45
  Bottom 0.127: JP1.10 23.62,2.48 24.96,3.3 28.89,3.3 33.97,4.06 v34.54,4.45
A3  (via drill 0.3)
  Top 0.254: 35.37,4.32 v35.37,4.25 35.94,5.02 36.81,6.27 U1.9
  Bottom 0.127: JP1.9 26.1,2.48 27.88,2.73 28.89,2.92 34.1,3.68 arc32 v35.37,4.25
A4  (via drill 0.3)
  Top 0.254: 36.26,4.45 v36.26,4.25 36.7,5.02 37.31,6 U1.10
  Bottom 0.127: JP1.8 28.77,2.48 34.16,3.24 35.75,3.68 arc65 v36.26,4.25
A5  (via drill 0.3)
  Top 0.127: U1.47 31.66,9.18 30.61,8.13 29.78,8.13 29.21,8.26 28.89,8.26 28.51,7.94 28.32,7.49 v28.19,5.02
  $GND 0.254: JP1.7 29.21,3.56 v28.19,5.02
AREF  (via drill 0.3)
  Top 0.254: U1.4 34.31,6.52 v34.48,6.35 | C14.P$1 v13.02,2.67
  Bottom 0.127: 16.32,2.67 17.91,3.62 23.37,3.75 24.7,4.38 28.57,4.45 31.81,5.97 v34.48,6.35
  Bottom 0.254: 16.32,2.67 v13.02,2.67 JP1.14
D0/RX0  (via drill 0.3)
  Top 0.254: U1.16 40.43,10.18 41.47,9.14 42.1,9.14 42.74,9.78 v42.74,9.91
  Bottom 0.254: JP1.3 41.34,3.24 41.34,5.52 42.23,6.41 42.23,9.27 42.74,9.78 v42.74,9.91
D1/TX0  (via drill 0.3)
  Top 0.254: U1.15 40.1,9.68 41.21,8.57 42.48,8.57 v42.99,9.08
  Bottom 0.254: JP1.2 41.91,5.33 42.99,6.41 v42.99,9.08
D3/RX2/GSM_TX  (via drill 0.3)
  Top 0.254: U1.14 39.72,9.18 40.89,8 42.93,8 44.7,9.78 49.28,9.78 53.66,5.4 58.23,5.4 61.15,2.48 v61.17,2.48
  Bottom 0.254: U5.1_ v61.17,2.48
D4/TX2/GSM_RX  (via drill 0.3)
  Top 0.254: U1.13 39.39,8.68 40.58,7.49 43.37,7.49 44.96,9.08 49.02,9.08 53.34,4.76 56.26,4.76 57.28,3.75 58.8,3.75 v60.07,2.48
  Bottom 0.254: U5.2_ v60.07,2.48
D5/CTS2  (via drill 0.3)
  Top 0.254: U1.24 39.45,14.18 39.81,14.54 42.1,14.54 | v42.61,3.75 42.67,3.68 43.81,3.68 44.26,4 45.02,4 46.35,2.73 JP2.1 | 42.1,14.54 43.5,14.54 44.26,13.78 v44.26,12.26 | 42.1,14.54 42.23,17.02 39.37,19.88 JP3.10
  Bottom 0.254: v44.26,12.26 43.62,11.68 43.62,6.22 42.55,5.14 v42.61,3.75
D6  (via drill 0.3)
  Top 0.254: U1.29 36.31,16.31 36.77,17.46 39.05,17.46 39.69,16.83 v39.75,16.64
  Bottom 0.254: v39.75,16.64 40.45,17.4 37.53,20.32 JP3.9
D7/SD_DET  (via drill 0.3)
  Top 0.254: U1.30 v35.81,17.21
  Bottom 0.254: X4.S/W 13.29,17.27 19.3,17.27 21.08,15.49 29.08,15.49 31.56,17.97 35.12,17.97 v35.81,17.21
D8/SD_CS  (via drill 0.3)
  Top 0.254: U1.11 37.81,5.81 37.34,4.83 v37.15,4.25 | v27.37,7.05 26.8,7.3 25.02,7.3 24.89,7.18 19.88,7.18 19.3,6.6 16.09,6.6 15.49,6.03 15.49,5.52 15.18,5.21 14.75,5.02 v14.37,4.64
  Bottom 0.254: X4.T2 v14.37,4.64 | v37.15,4.25 37.15,4.76 36.39,5.52 36.39,7.24 35.81,7.81 32.38,7.81 30.99,7.05 v27.37,7.05
D9/VOLT  (via drill 0.3)
  Top 0.127: U1.12 38.33,7.94
  Top 0.254: 33.59,19.68 JP3.8 35.62,21.08 36.11,20.41 36.49,20.26 | 33.59,19.68 R6.P$1 | U1.12 38.31,7.94 | 38.33,7.94 v38.73,7.87 | 33.59,19.68 33.59,19.75 | 36.49,20.26 R3.P$2 | v38.1,20.83 37.47,20.19 36.49,20.26
  Bottom 0.254: v38.1,20.83 38.42,20.83 42.23,17.02 42.23,15.94 38.29,11.87 38.29,10.22 38.86,9.65 38.86,8 v38.73,7.87
D10  (via drill 0.3)
  Top 0.254: U1.27 37.31,15.66 38.23,16.51 v38.73,16.51
  Bottom 0.254: v38.73,16.51 39.18,17.65 37.02,19.81 35.81,19.81 35.37,19.75 35.05,19.75 32.58,20.26 JP3.7
D11  (via drill 0.3)
  Top 0.254: U1.25 39.16,14.9 39.37,15.11 40.26,15.11 41.4,16.26 v41.4,16.51
  Bottom 0.254: v41.4,16.51 41.4,16.26 40.45,15.3 38.67,15.3 38.04,16.19 38.16,17.65 36.64,19.18 34.48,19.18 32.07,19.75 JP3.6
D12  (via drill 0.3)
  Top 0.254: U1.28 36.81,15.92 v37.34,16.7
  Bottom 0.254: v37.34,16.7 37.21,17.72 36.39,18.54 34.48,18.54 31.43,19.18 28.26,20.32 JP3.5
D13/RLED  (via drill 0.3)
  Top 0.254: R7.P$2 5.88,21.34 v5.97,21.34 | U1.26 37.81,15.39 38.1,15.68 39.94,15.68 40.51,16.26 40.51,17.4 39.37,18.54 31.56,18.54 30.54,19.56 26.54,19.56 JP3.4
  Bottom 0.254: v5.97,21.34 7.87,21.34 8.89,20.32 13.97,20.32 15.05,19.24 21.78,19.24 JP3.4
D+  (via drill 0.3)
  Top 0.254: X3.3 6.03,11.43 6.48,11.87 v6.48,12.26 | U1.34 33.81,15.4 33.02,16.13 32.51,16.51 v32.26,16.51
  Bottom 0.254: v6.48,12.26 6.48,13.02 6.67,15.11 8.26,16.7 10.73,16.7 11.37,16.07 18.54,16.07 20.26,14.35 29.91,14.35 31.94,16.38 v32.26,16.51
D-  (via drill 0.3)
  Top 0.254: X3.2 5.35,12.08 v5.52,12.26 5.32,12.11 | U1.33 34.31,15.66 v32.83,17.21
  Bottom 0.254: v5.52,12.26 5.52,13.27 6.03,15.49 7.87,17.27 11.3,17.27 11.87,16.7 18.86,16.7 20.64,14.92 29.53,14.92 31.94,17.34 32.7,17.34 v32.83,17.21
EN  (via drill 0.3)
  Top 0.254: U2.3 v14.07,8.89 14.57,8.38 17.46,8.38 17.78,8.7 17.78,11.37 18.41,12 20.89,12 21.08,12.19 21.08,15.37 21.4,15.75 21.4,19.62 19.43,21.59 JP3.2 17.59,20.13 17.59,19.11 17.91,18.53 U4.P$1
  Bottom 0.254: R1.P$1 8.55,11.52 10.1,9.97 12.99,9.97 v14.07,8.89
GND  (via drill 0.3, 0.5, 0.6)
  Top 0.178: U7.18 24.37,8.59 v24.75,8.59
  Top 0.203: U7.20 23.52,9.62 arc-90 23.5,9.62 | U7.11 23.11,9.62 | U7.9 22.99,10.42 U7.25
  Top 0.254: v1.52,17.53 D3.CATHODE | U1.42 33.42,11.68 v34.51,11.43 | U1.35 33.31,13.72 | 33.31,13.72 33.31,13.7 | U1.5 34.81,9.27 v34.51,11.43 | C21.P$2 v42.04,11.81 | U1.18 37.42,11.18 v36.58,11.43 | C18.P$2 v29.08,18.01 | C19.P$2 v14.71,6.6 | C4.P$1 v32.19,4.95 | X1.1 9.79,14.62 v9.78,13.97 | R12.P$1 53.24,2.26 v52.96,2.54 | R11.P$2 v46.61,17.08 | R6.P$2 v33.02,20.89 | C17.P$2 v20.26,4.25 | U1.THERMAL v34.51,11.43 | 23.11,9.62 U7.25 23.5,9.62 | U6.P7 | 33.31,13.72 v34.51,11.43 | C14.P$2 JP1.13 | R8.P$2 v4.95,5.84 | C3.P$2 v16.32,5.52 | C16.P$1 v53.59,19.43
  Top 0.305: v22.67,13.02 22.85,13.58 U6.P7 | U6.P5 24.15,13.76 v24.45,13.46 | U6.P1 22.2,16.8 v22.16,17.34 | 1.39,14.72 X3.S1 | X3.S5 1.4,12.62 | X3.S5 v1.52,11.43 X3.S6 1.39,10.22 X3.S2 X3.S4 | X3.S5 X3.S1 | X3.S1 X3.S3
  Top 0.406: D2.A v66.17,16.43 | C1.P$2 v29.59,9.65 | C8.P$1 v19.01,8.64 | v19.01,10.6 C20.P$1 | v32.51,6.99 C2.P$1 | C9.P$2 v21.02,4.25 | C26.P$2 v18.92,13.34 | C25.P$2 v18.41,13.88 | C11.P$1 v18.54,9.65 | C7.P$2 v40.11,7.05 | X3.5 v5.4,10.13
  Top 0.508: U3.2 v10.22,4.45 | U2.2 v15.3,10.41
  Top 0.533: C6.P$2 v15.43,13.84
  Top 0.61: C13.P$2 v63.69,14.8
  Top 1.27: C24.P$2 v51.49,19.58
  $GND 0.406: v57.28,22.29 57.28,22.04 | v62.87,22.29 62.87,21.97 | v67.82,0.7 67.56,0.95 | v64.52,0.7 64.52,0.95 | 14.86,2.6 17.02,2.86
  $GND 0.61: 22.44,5.4 25.23,5.33 | 24.89,7.24 25.21,5.65 | 27.24,5.65 28.51,6.16 | v22.16,17.34 21.53,17.72 | 22.42,12.45 v22.67,13.02 22.92,14.03 | v24.45,13.46 24.07,14.16 | 19.43,9.65 21.27,9.65 | 22.12,5.14 v22.12,6.41 22.12,7.37 | v29.59,9.65 28.96,9.21 | v33.02,20.89 33.02,19.75 | v64.39,3.94 64.26,3.62 | v62.53,5 61.59,5.46 | v45.53,11.41 46.1,11.41 | 12.95,4.19 14.35,3.17 15.24,2.54
  $GND 0.813: 43.18,2.54 41.08,3.11
  $GND 1.27: 47.5,2.1 46.23,0.83 44.9,0.83 JP1.1 43.24,2.48 | JP1.13 14.86,2.6
  Bottom 0.254: U5.19_ v45.53,11.41 | U5.13_ v47.56,5.25 | 15.88,18.54 v15.56,18.22 X4.G3 | v26.86,18.22 26.26,18.03 X4.G1 | 22.1,18.16 22.1,18.2 X4.T6 | X4.G7 17.96,5.28 v17.97,5.52 | 16,5.52 X4.G6 v16.32,5.52 | U5.8_ 53.47,2.03 v52.96,2.54 | U5.21_ 46.35,13.64 v46.35,14.16 | SW2.O 5.39,9.02 v5.46,9.02 | v26.42,5.46 X4.G8 | SW1.P$4 v6.1,7.87
  Bottom 0.406: 17.65,5.83 X4.G7 | v58.52,11.62 U5.75_ | 22.1,18.16 v22.16,17.34 | v57.47,4.7 57.21,4.42 U5.45_ | X4.G4 11.06,18.23 v11.05,18.22 | U5.27_ v54.57,18.1 | C12.P$2 v65.91,14.65 | X4.G2 v15.56,18.22
  Bottom 0.559: v60.07,5.02 59.56,5.52
  Bottom 0.61: C10.P$2 v67.22,10.31 | v62.24,11.75 U5.63_ | v64.92,11.66 64.67,11.41 U5.36_ | v64.92,10.56 64.67,10.31 U5.37_ | X4.G5 v10.22,4.45 | X4.C5 v22.12,6.41
  Bottom 0.813: C5.P$2 v6.49,9.34
  Bottom 1.27: C15.P$2 v67.75,15.37
  other vias: 9.78,15.24 9.78,12.7 57.4,15.81 62.87,15.81 58.74,14.61 61.66,14.61 65.15,5.27 68.71,5.27 61.71,3.33 62.23,6.41 62.23,7.81 64.01,2.26 62.85,2.64 61.04,3.98 60.58,7.81 60.58,6.41 68.71,1.97 55.12,9.21 51.05,5.84 55.12,6.29 58.48,6.29 58.48,9.21 52.01,9.14 60.07,14.54 25.34,18.22 57.4,18.41 62.87,18.22 55.75,11.56 23.3,10.22 51.69,11.43
  pour Bottom (isolate 0.254, rank 4, no thermals): 57.02,22.67 63.12,22.67 63.12,15.68 61.85,14.41 58.29,13.78 57.02,13.78
  pour Bottom (isolate 0.254, rank 4, no thermals): 64.26,5.52 69.34,5.52 69.34,0.44 64.26,0.44
  pour Bottom (isolate 0.254, rank 4, no thermals): 64.9,1.71 62.71,2.43 61.65,3.09 60.33,4.13 60.33,7.89 60.77,8.2 62.06,8.23 62.48,7.94 62.48,5.4 62.92,4.64 63.12,4.38 64.9,4.38
  pour Bottom (isolate 0.61, rank 4): 58.29,14.41 59.44,13.91 60.71,13.91 61.85,14.41
  pour $GND (isolate 0.61): 0,22.86 0,0 69.85,0 69.85,22.86
  pour Bottom (isolate 0.61, no thermals): 49.53,4.45 60.96,4.45 60.96,13.97 49.53,13.97
GPS_1PPS  (via drill 0.3)
  Top 0.254: v53.09,15.56 52.51,14.92 v47.69,11.43 | U1.39 31.15,13.18 v30.8,13.4
  $GND 0.254: v47.69,11.43 48.26,10.86 48.26,7.11 47.69,6.54
  Route15 0.254: v30.8,13.4 31.56,13.65 34.99,13.65 35.81,14.48 44.51,14.48 v45.53,15.49
  Bottom 0.254: U5.60_ 53.09,14.63 v53.09,15.56 | v47.69,11.43 47.69,14.54 46.99,15.24 v45.53,15.49
GPS_ANT
  Bottom 0.61: U5.68_ 61.34,5.02 arc58 X6.D
GPS_EN_  (via drill 0.3)
  Top 0.254: v51.88,15.62 52.58,16.32 53.59,16.32 56.96,14.73 62.42,9.27 65.22,9.27 v66.04,8.45
  Bottom 0.191: 66.02,7.99 R9.P$1
  Bottom 0.254: JP4.1 66.14,7.88 R9.P$1 | U5.59_ 51.62,14.67 51.63,15.37 v51.88,15.62 | 66.02,7.99 R9.P$1 v66.04,8.45
GSM_ANT
  Bottom 0.61: U5.32_ X5.D
GSM_DCD  (via drill 0.3)
  Top 0.254: v56.77,2.48 55.82,3.43 JP10.2
  Bottom 0.254: U5.5_ v56.77,2.48
GSM_DTR  (via drill 0.3)
  Top 0.254: 53.91,1.21 R12.P$2 54.36,1.17 v55.67,2.48
  Bottom 0.254: v55.67,2.48 U5.6_
MISO  (via drill 0.3)
  Top 0.254: v27.75,16.89 28.32,16.26 28.32,13.27 27.56,11.37 27.56,10.73 v28.13,10.1 | U1.21 40.17,12.68 40.39,12.76 40.77,12.76 41.15,12.45 41.15,10.29 41.59,9.84 v41.78,9.84
  Route15 0.254: v41.78,9.84 37.47,9.84 37.27,9.65 34.29,9.72 32.51,7.87 31.81,7.43 31.3,7.43 29.65,8.26 v28.13,10.1
  Bottom 0.254: X4.T7 20.32,17.27 21.4,16.07 24.38,16.07 24.83,17.08 27.56,17.08 v27.75,16.89 | JP1.4 37.4,1.27 38.61,2.54 40.51,3.37 40.77,3.75 40.77,5.78 41.34,6.35 41.34,9.4 v41.78,9.84
MOSI  (via drill 0.3)
  Top 0.254: U1.19 39.69,11.68 40.39,11.3 v40.51,11.24 | v40.07,4 39.5,3.56 32.64,3.56 32.38,3.81 27.94,3.81 27.3,4.45 27.3,5.71 v26.23,6.6
  Bottom 0.254: JP1.5 34.92,1.27 36.2,2.54 36.96,2.73 38.61,3.17 39.88,3.75 v40.07,4 40.07,5.91 40.77,6.6 40.77,7.37 40.51,7.62 v40.51,11.24 | 19.43,5.54 X4.T3 19.42,6.53 20.13,7.3 25.84,7.3 26.23,6.86 v26.23,6.6
MPU_INT
  Top 0.203: 20.95,8.83 21.35,9.22 U7.12
  Top 0.254: U1.41 29.52,12.18 29.02,11.68 28.83,10.22 28.83,9.14 27.88,8.13 27.5,7.87 21.34,7.87 20.95,8.26 20.95,8.83
N$1
  Top 0.254: 2.54,5.4 D4.CATHODE R2.P$1
N$3
  Top 0.254: U3.1 10.67,2.6 7.6,2.6 6.84,3.81 R2.P$2
N$4
  Top 0.254: R8.P$1 6.92,5.84 8.32,3.5 U3.5
N$5
  Top 0.254: U1.1 32.75,7.94 32.02,7.56 31.66,6.94 C2.P$2 | 31.41,6.5 C2.P$2 | X2.P$1 30.18,6.79 31.47,6.79 C2.P$2
N$6  (via drill 0.3)
  Top 0.254: JP2.2 49.34,0.45 56.39,0.45 57.87,1.93 v57.87,2.48
  Bottom 0.254: U5.4_ v57.87,2.48
N$7
  Top 0.254: U1.2 33.31,6.11 33.31,6 arc-90 33.02,5.71 32.22,5.65 arc58 C4.P$2 31.41,5.14 30.61,5.14 30.23,4.77 X2.P$2
N$8
  Top 0.254: D3.ANODE 3.56,17.53 5.59,19.56 R7.P$1
N$11
  Bottom 0.254: SW2.P arc38 6.03,11.43 arc57 7.24,11.75 7.28,12.87 R1.P$2
N$23
  Top 0.203: U7.10 21.2,10.02 20.83,9.65 C11.P$2
N$29  (via drill 0.3)
  Top 0.254: C16.P$2 53.8,17.34 54.94,17.34 v55.77,18.17
  Bottom 0.254: v55.77,18.17 U5.28_
PWRKEY  (via drill 0.3)
  Top 0.254: U1.22 39.91,13.18 40.2,13.4 42.35,13.4 42.99,12.76 42.99,11.68 44.13,10.54 49.4,10.54 52.83,7.11 64.33,7.11 65,7.79 v65.02,7.79
  Bottom 0.254: U5.39_ v65.02,7.79
RTS2  (via drill 0.3)
  Top 0.254: U1.23 39.72,13.68 40.01,13.97 42.74,13.97 43.56,13.14 43.56,11.94 44.07,11.43 v44.64,11.43 | v58.97,2.48 58.27,3.17 56.96,3.17 56.07,4.06 49.47,4.06 49.02,4.51 46.99,4.51 45.91,5.14 43.5,5.14 v43.43,5.08
  Bottom 0.254: U5.3_ v58.97,2.48 | v43.43,5.08 44.13,5.78 44.13,10.92 v44.64,11.43
RX5/GPS_TX  (via drill 0.3)
  Top 0.254: U1.38 31.53,13.68 31.37,13.84 v31.05,14.35
  Route15 0.254: v54.42,13.97 54.42,13.46 53.78,12.83 53.15,12.83 52.64,13.34 45.97,13.34 45.28,13.97 36.7,13.97 35.69,12.95 31.69,12.95 31.43,12.7 30.48,12.7 30.1,13.08 30.1,13.78 30.67,14.35 v31.05,14.35
  Bottom 0.254: v54.42,13.97 U5.61_
SCK  (via drill 0.3)
  Top 0.254: U1.20 40.33,12.18 v40.45,12.06 | v21.22,6.41 22.49,5.08 23.56,5.08 26.1,2.48 30.54,2.48 JP1.6
  Bottom 0.254: JP1.6 32.45,1.27 33.66,2.48 35.12,2.86 36.2,3.24 38.48,3.75 39.18,4.06 39.43,4.32 39.43,9.91 38.99,10.35 38.99,11.11 39.94,12.06 v40.45,12.06
  Bottom 0.406: X4.T5 v21.22,6.41
SCL  (via drill 0.3)
  Top 0.203: U7.23 25.36,10.82 25.78,11.24 25.78,11.87 v26.04,12.76
  Top 0.254: R4.P$1 41.3,19.35 42.1,18.54 42.1,18.1 42.86,17.34 42.86,15.68 43.24,15.3 44.2,15.3 v44.45,15.56 | R4.P$1 41.3,19.77 | U1.32 34.81,15.99 34.35,16.45 v34.29,16.7 | R4.P$1 41.3,20.98 JP3.11 | U6.P4 25.4,15.94 26.42,14.92 26.42,13.4 v26.04,12.76
  Route15 0.254: v34.29,16.7 34.37,16.05 35.45,14.99 43.88,14.99 v44.45,15.56
  Bottom 0.254: v34.29,16.7 34.35,13.84 32.19,11.87 26.92,11.87 v26.04,12.76
SDA  (via drill 0.3)
  Top 0.203: U7.24 25.21,12.24 25.34,13.59 v25.4,13.65
  Top 0.254: U1.31 35.31,16.44 v35.18,16.64 | v43.62,16.07 43.69,16.13 43.69,18.54 44.01,18.86 44.45,18.86 44.87,19.28 R5.P$1 44.87,21.17 JP3.12 | U6.P3 23.5,15.42 23.94,14.99 24.77,14.99 25.4,14.29 v25.4,13.65
  Route15 0.254: v35.18,16.64 36.2,15.62 43.12,15.62 v43.62,16.07
  Bottom 0.254: v35.18,16.64 35.18,16.76 34.67,17.4 33.91,17.4 33.53,17.02 33.53,16.38 33.72,15.94 33.72,14.16 31.94,12.64 27.43,12.64 26.42,13.65 v25.4,13.65
SIM_CLK  (via drill 0.3)
  Top 0.254: v23.92,17.4 25.97,17.4 27.69,15.68 27.69,13.21 26.99,11.68 26.99,10.54 27.43,9.65 v27.75,9.27
  Route15 0.254: v47.37,8.26 42.67,8.26 42.04,8.89 40.45,8.89 40.13,9.21 37.85,9.21 37.72,9.08 34.67,9.08 33.53,7.62 33.21,6.54 32.89,6.22 32.19,6.22 29.27,7.81 v27.75,9.27
  Bottom 0.254: U5.16_ 47.22,8.11 v47.37,8.26
  Bottom 0.406: X4.C3 v23.92,17.4
SIM_DATA  (via drill 0.3)
  Top 0.254: v26.86,8.89 26.42,10.41 26.42,11.75 27.11,13.27 27.11,15.24 25.65,16.7 23.56,16.7 v23.05,17.08
  Route15 0.254: v47.5,7.39 47.33,7.56 41.21,7.49 40.83,7.87 40.45,7.87 39.69,8.64 38.29,8.64 38.1,8.45 34.99,8.32 34.16,7.37 33.72,6.22 33.27,5.78 33.02,5.65 31.94,5.65 28.96,7.37 v26.86,8.89
  Bottom 0.254: X4.C7 21.22,17.2 21.72,16.64 22.61,16.64 v23.05,17.08 | U5.15_ 47.12,7.01 v47.5,7.39
SIM_RST  (via drill 0.3)
  Top 0.254: v45.59,2.1 45.15,2.54 31.37,2.54 30.99,2.92 26.8,2.92 24.04,5.68 23.59,5.68 23.02,6.25 v23.02,6.41
  Bottom 0.254: U5.17_ 45.4,9.21 45.15,8.95 45.15,2.54 v45.59,2.1
  Bottom 0.406: X4.C2 v23.02,6.41
SIM_VDD  (via drill 0.3)  (1 unrouted)
  Top 0.254: v44.45,3.17 44.32,3.05 31.88,3.05 31.56,3.37 27.43,3.37 24.36,6.43 v23.92,6.41 | C9.P$1 22.65,4.21
  Top 0.406: C9.P$1 v23.11,4.38
  Bottom 0.254: v44.45,3.17 44.64,3.37 44.64,9.59 45.36,10.31 U5.18_
  Bottom 0.406: X4.C1 23.92,5 23.37,4.45 23.18,4.45 v23.11,4.38
  Bottom 0.5: X4.C1 v23.92,6.41
STATUS  (via drill 0.3)
  Top 0.254: U1.48 v31.58,8.19
  Route15 0.254: v63.44,4.81 63.44,8.26 61.09,10.6 58.42,10.6 56.77,12.26 54.93,12.26 54.29,11.62 52.64,11.62 51.94,12.32 45.34,12.32 44.7,12.95 39.56,12.95 37.02,10.41 34.04,10.41 v31.58,8.19
  Bottom 0.254: U5.42_ v63.44,4.81
SWCLK  (via drill 0.3)
  Top 0.254: U1.45 31.58,10.18 v30.61,9.59 | JP10.1 47.05,3.43 45.34,4.57 44.07,4.57 43.69,4.32 43.18,4.32 42.67,4.7 v38.8,4.7
  Bottom 0.254: v30.61,9.59 31.56,10.16 31.94,10.41 34.1,12.57 TP1.P$1 36.89,12.57 37.72,11.75 37.72,9.84 37.91,9.65 37.91,6.48 38.8,5.59 v38.8,4.7
SWDIO  (via drill 0.3)
  Top 0.127: U1.46 31.65,9.68 30.8,8.89 v30.1,8.83
  Bottom 0.254: v30.1,8.83 30.92,8.89 TP2.P$1
TX5/GPS_RX  (via drill 0.3)
  Top 0.254: U1.37 32,14.26 v32,14.73
  Route15 0.254: v55.44,13.97 55.44,13.65 54.04,12.26 52.9,12.26 52.26,12.83 45.66,12.83 45.02,13.46 37.66,13.46 36.51,12.32 32,12.32 31.88,12.19 30.16,12.19 29.46,12.89 29.46,14.03 30.54,15.11 31.37,15.11 v32,14.73
  Bottom 0.254: U5.62_ 55.82,14.35 v55.44,13.97
VBAT  (via drill 0.3)
  Top 0.254: v5.65,16.38 v7.37,14.67 | v12.38,15.3 11.79,15.11
  Top 0.508: U3.3 D1.A
  Top 0.61: 11.79,14.61 11.79,15.11 11.79,16.05 11.91,16.03 | X1.2 11.79,10.6 D1.A | C6.P$1 15.81,16.07
  Top 0.813: X1.2 11.79,14.61
  Top 1.27: 11.91,16.03 11.94,16.07 15.81,16.07 19.56,16.07 20.19,16.7 20.19,18.67 19.62,19.49 U4.P$2
  Bottom 0.254: v7.37,14.67 8.76,16.07 10.34,16.07 11.1,15.3 v12.38,15.3
  Bottom 0.305: SW2.S v5.65,16.38
VBAT_ON  (via drill 0.3, 0.6)
  Top 0.254: R3.P$1 v35.18,20.45
  Top 0.508: R11.P$1 v48.59,19.62
  Top 1.27: JP3.1 16.51,18.88 U4.P$3 | C24.P$1 v48.59,19.62
  Route15 0.406: v35.18,20.45 35.18,19.62
  Route15 1.27: v62.99,13.1 58.15,13.1 55.12,16.13 53.15,17.14 50.67,17.97 48.58,19.62 | 48.58,19.62 35.18,19.62 17.78,19.62 JP3.1 | v48.59,19.62 48.58,19.62
  pour Bottom (isolate 0.254, no thermals): 63.37,12.26 arc-19 65.28,11.87 arc-9 65.98,10.6 arc99 68.39,13.14 arc62 68.39,13.84 arc29 63.17,13.93 arc14 63.17,13.92 arc85
  pour Top (isolate 0.254, no thermals): 62.93,13.53 62.61,13.02 62.93,12.7 64.71,12.83 67.31,12.76 67.37,13.65 66.48,13.65 65.21,13.59
VBUS  (via drill 0.3, 0.6)
  Top 0.127: D4.ANODE
  Top 0.254: D4.ANODE 1.03,5.41 2.41,6.79 8.48,6.79
  Top 0.406: X3.1 4.67,12.73 5.14,13.21
  Top 0.508: v14.1,12.06 U2.1
  Top 0.61: 8.31,13.21 8.31,16.76 9.4,17.84 v9.4,21.21 | 8.16,9.04 D1.C 8.48,6.79 U3.4 | 8.16,9.04 8.21,10.99 | 8.21,10.99 8.31,13.21 | 5.14,13.21 8.31,13.21 | v10.48,10.99 8.21,10.99 | v8.83,9.53 8.16,9.04
  Bottom 0.508: v10.48,10.99 13.02,10.99 v14.1,12.06
  Bottom 0.61: v9.4,21.21 14.41,21.21 15.62,20 20,20 JP3.3
  Bottom 0.813: C5.P$1 v8.83,9.53
VDD_EXT_2V8
  Bottom 0.254: JP4.2 66.14,6.98 R9.P$2 66.04,7.01 U5.40_
VDDCORE
  Top 0.254: U1.43 30.26,11.18 C1.P$1

### Text on the board
tPlace: Forschungsgemeinschaft / Alternative Raumfahrt | FAR | #4 | FROM HOME
bPlace: BAT | En | USB | 13 | 12 | ~ | 9 | 6 | ~ | 5 | 21 | 20 | 11~ | 10~ | SCL | SDA | swclk | swdio | MOSI | MISO | 3V | ARf | GND | A0 | A1 | A2 | A3 | A4 | A5 | SCK | 24 | 23 | 22 | RX | TX | GND | RST | 0 | 1